# Altium schematic sheet STM32F072.SchDoc
size A4
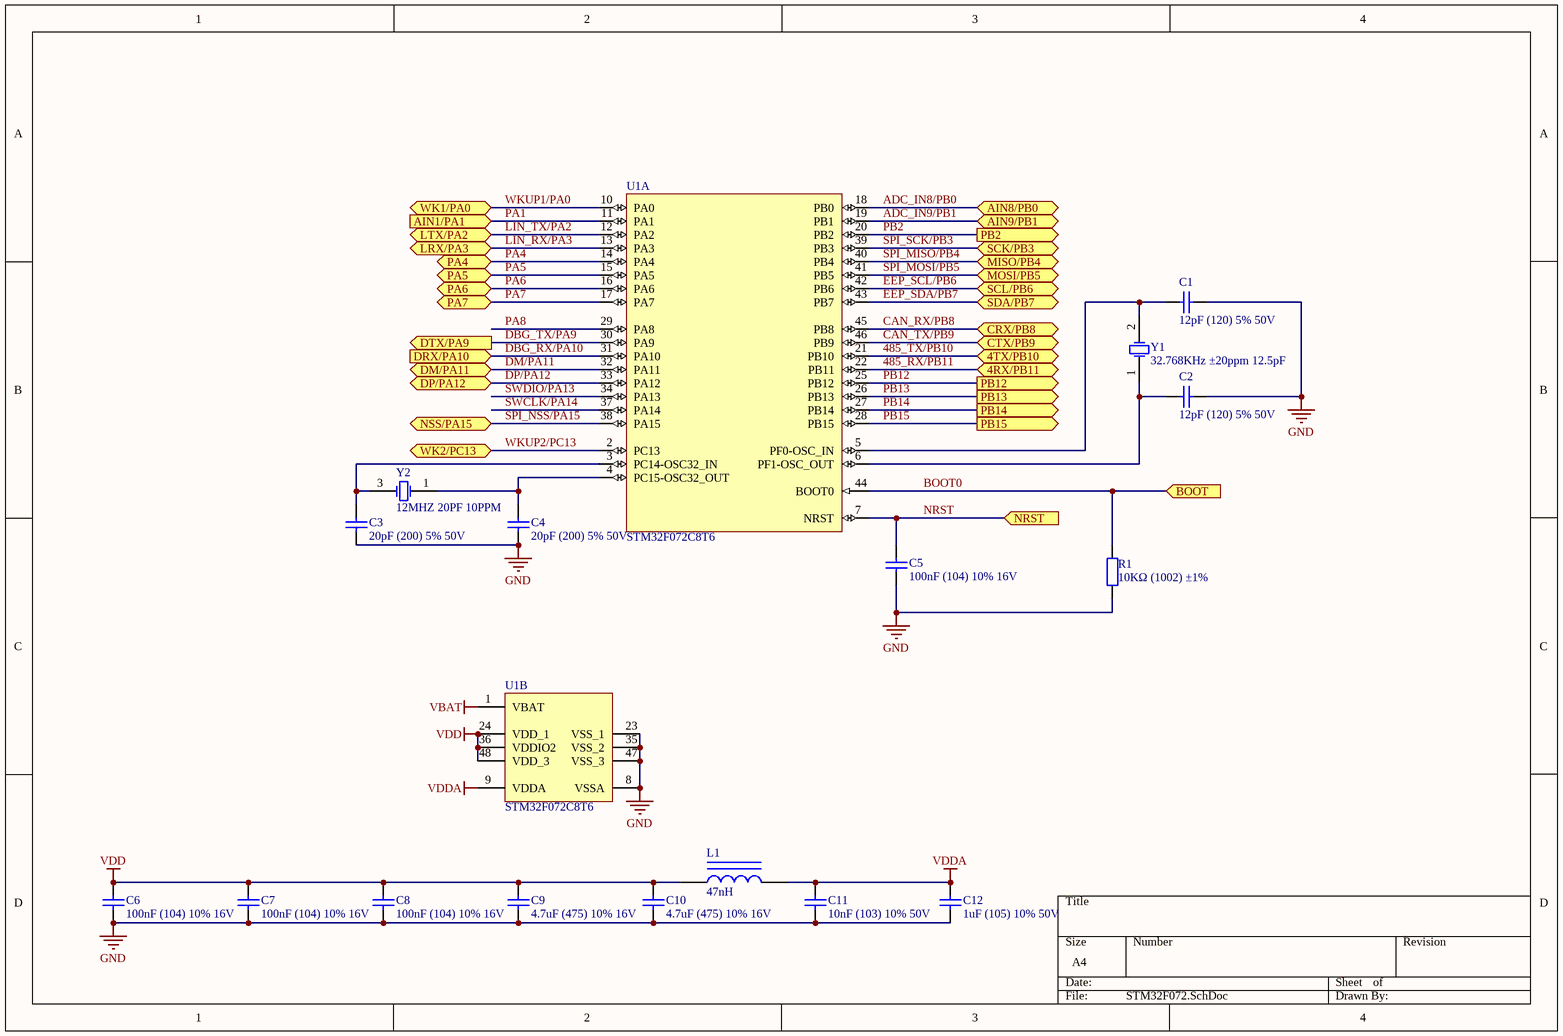
[diagram p0: STM32F072.SchDoc]

## Parts
C1  12pF (120) 5% 50V  [0402_C]
C2  12pF (120) 5% 50V  [0402_C]
C3  20pF (200) 5% 50V  [0402_C]
C4  20pF (200) 5% 50V  [0402_C]
C5  100nF (104) 10% 16V  [0402_C]
C6  100nF (104) 10% 16V  [0402_C]
C7  100nF (104) 10% 16V  [0402_C]
C8  100nF (104) 10% 16V  [0402_C]
C9  4.7uF (475) 10% 16V  [0603_C]
C10  4.7uF (475) 10% 16V  [0603_C]
C11  10nF (103) 10% 50V  [0402_C]
C12  1uF (105) 10% 50V  [0603_C]
L1  47nH  [0603_L]
R1  10KΩ (1002) ±1%  [0603_R]
U1  STM32F072C8T6  [LQFP-48_7x7x05P]  (parts A,B of 2)
Y1  32.768KHz ±20ppm 12.5pF  [SMD-3215_2P FC - 135]
Y2  12MHZ 20PF 10PPM  [SMD-3225_4P]

## Ports
4RX/PB11, 4TX/PB10, AIN1/PA1 (in), AIN8/PB0, AIN9/PB1, BOOT (in), CRX/PB8, CTX/PB9, DM/PA11, DP/PA12, DRX/PA10 (in), DTX/PA9 (out), LRX/PA3, LTX/PA2, MISO/PB4, MOSI/PB5, NRST (in), NSS/PA15, PA4, PA5, PA6, PA7, PB2 (out), PB12 (out), PB13 (out), PB14 (out), PB15 (out), SCK/PB3, SCL/PB6, SDA/PB7, WK1/PA0, WK2/PC13

## Nets
GND: C1.2 C2.2 C3.1 C4.1 C5.1 C6.1 C7.1 C8.1 C9.1 C10.1 C11.2 C12.2 R1.1 U1.8(VSSA) U1.23(VSS_1) U1.35(VSS_2) U1.47(VSS_3)
VBAT: U1.1(VBAT)
VDD: C6.2 C7.2 C8.2 C9.2 C10.2 L1.1 U1.24(VDD_1) U1.36(VDDIO2) U1.48(VDD_3)
VDDA: C11.1 C12.1 L1.2 U1.9(VDDA)
485_RX/PB11: U1.22(PB11) ; port 4RX/PB11
485_TX/PB10: U1.21(PB10) ; port 4TX/PB10
ADC_IN8/PB0: U1.18(PB0) ; port AIN8/PB0
ADC_IN9/PB1: U1.19(PB1) ; port AIN9/PB1
BOOT0: R1.2 U1.44(BOOT0) ; port BOOT
CAN_RX/PB8: U1.45(PB8) ; port CRX/PB8
CAN_TX/PB9: U1.46(PB9) ; port CTX/PB9
DBG_RX/PA10: U1.31(PA10) ; port DRX/PA10
DBG_TX/PA9: U1.30(PA9) ; port DTX/PA9
DM/PA11: U1.32(PA11) ; port DM/PA11
DP/PA12: U1.33(PA12) ; port DP/PA12
EEP_SCL/PB6: U1.42(PB6) ; port SCL/PB6
EEP_SDA/PB7: U1.43(PB7) ; port SDA/PB7
LIN_RX/PA3: U1.13(PA3) ; port LRX/PA3
LIN_TX/PA2: U1.12(PA2) ; port LTX/PA2
NRST: C5.2 U1.7(NRST) ; port NRST
PA1: U1.11(PA1) ; port AIN1/PA1
PA4: U1.14(PA4) ; port PA4
PA5: U1.15(PA5) ; port PA5
PA6: U1.16(PA6) ; port PA6
PA7: U1.17(PA7) ; port PA7
PA8: U1.29(PA8)
PB2: U1.20(PB2) ; port PB2
PB12: U1.25(PB12) ; port PB12
PB13: U1.26(PB13) ; port PB13
PB14: U1.27(PB14) ; port PB14
PB15: U1.28(PB15) ; port PB15
SPI_MISO/PB4: U1.40(PB4) ; port MISO/PB4
SPI_MOSI/PB5: U1.41(PB5) ; port MOSI/PB5
SPI_NSS/PA15: U1.38(PA15) ; port NSS/PA15
SPI_SCK/PB3: U1.39(PB3) ; port SCK/PB3
SWCLK/PA14: U1.37(PA14)
SWDIO/PA13: U1.34(PA13)
WKUP1/PA0: U1.10(PA0) ; port WK1/PA0
WKUP2/PC13: U1.2(PC13) ; port WK2/PC13
NetC1_1: C1.1 U1.5(PF0-OSC_IN) Y1.2(OSC2)
NetC2_1: C2.1 U1.6(PF1-OSC_OUT) Y1.1(OSC1)
NetC3_2: C3.2 U1.3(PC14-OSC32_IN) Y2.3(OSC2)
NetC4_2: C4.2 U1.4(PC15-OSC32_OUT) Y2.1(OSC1)

## Library data of the parts
C1 C2 = 0402 12pF (120) 5% 50V: 贴片电容; ComponentLink1Description: 供应商链接; ComponentLink1URL: http://www.szlcsc.com/product/details_1899.html; Package: 0402; Supplier: LC; SuppliersPartNumber: C1547
C3 C4 = 0402 20pF (200) 5% 50V: 贴片电容; ComponentLink1Description: 供应商链接; ComponentLink1URL: http://www.szlcsc.com/product/details_1906.html; Package: 0402; Supplier: LC; SuppliersPartNumber: C1554
C5-C8 = 0402 100nF (104) 10% 16V: 贴片电容; ComponentLink1Description: 供应商链接; ComponentLink1URL: http://www.szlcsc.com/product/details_1877.html; Package: 0402; Supplier: LC; SuppliersPartNumber: C1525
C9 C10 = 0603 4.7uF (475) 10% 16V: 贴片电容; ComponentLink1Description: 供应商链接; ComponentLink1URL: http://www.szlcsc.com/product/details_20375.html; Package: 0603; Supplier: LC; SuppliersPartNumber: C19666
C11 = 0402 10nF (103) 10% 50V: 贴片电容; ComponentLink1Description: 供应商链接; ComponentLink1URL: http://www.szlcsc.com/product/details_15869.html; Package: 0402; Supplier: LC; SuppliersPartNumber: C15195
C12 = 0603 1uF (105) 10% 50V: 贴片电容; ComponentLink1Description: 供应商链接; ComponentLink1URL: http://www.szlcsc.com/product/details_16531.html; Package: 0603; Supplier: LC; SuppliersPartNumber: C15849
L1 = 0603 47nH: 贴片电感; ComponentLink1Description: 供应商链接; ComponentLink1URL: http://www.szlcsc.com/product/details_30437.html; Package: 0603; Supplier: LC; SuppliersPartNumber: C29683
R1 = 0603 10KΩ (1002) 1%: 贴片电阻; ComponentLink1Description: 供应商链接; ComponentLink1URL: http://www.szlcsc.com/product/details_26547.html; Package: 0603; Supplier: LC; SuppliersPartNumber: C25804
U1 = STM32F072C8T6: ARM; Package: LQFP-48_7x7x05P; Supplier: LC; Comment_1: STM32F072C8T6
Y1 = SMD-3215_2P 32.768KHz 20ppm 12.5pF: 贴片晶振; ComponentLink1Description: 供应商链接; ComponentLink1URL: http://www.szlcsc.com/product/details_33310.html; Package: SMD-3215_2P; Supplier: LC; SuppliersPartNumber: C32346
Y2 = SMD-3225_4P  12MHZ 20PF 10PPM: 贴片晶振; ComponentLink1Description: 供应商链接; ComponentLink1URL: http://www.szlcsc.com/product/details_9522.html; Package: SMD-3225_4P; Supplier: LC; SuppliersPartNumber: C9002